# EAGLE design main (EAGLE 9.3.0)
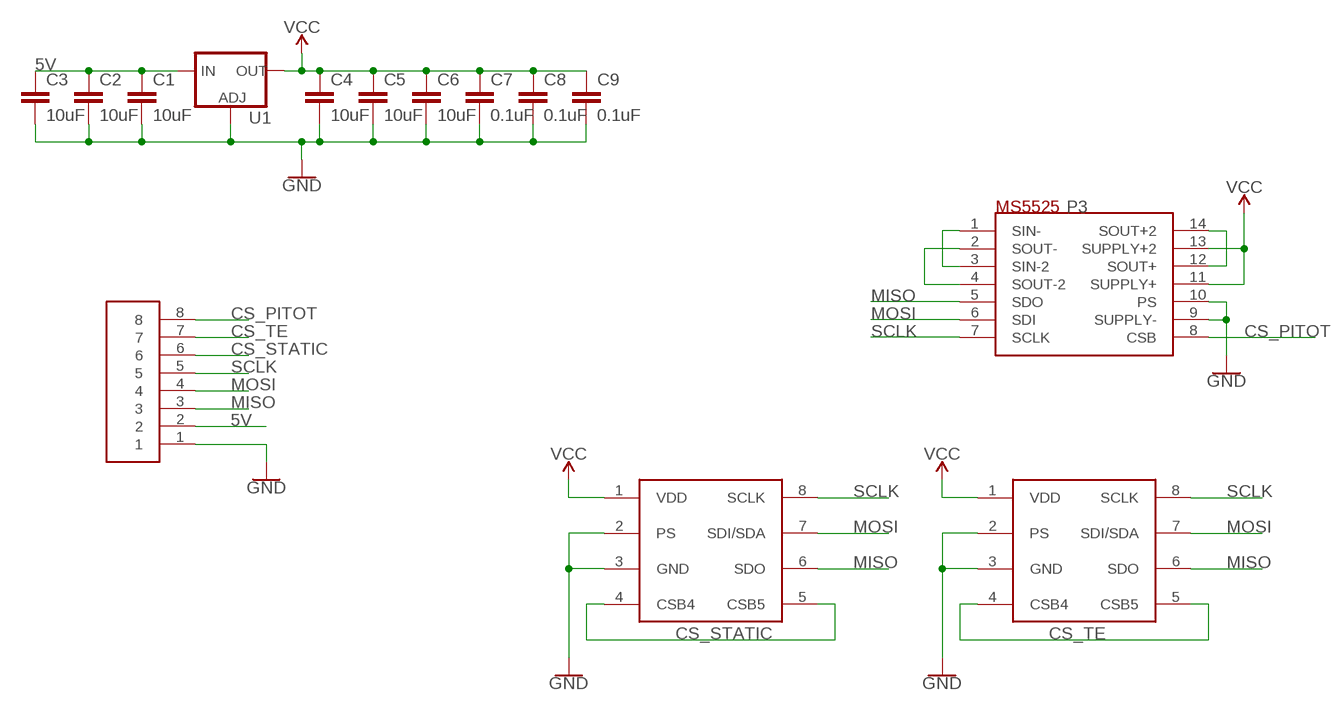
[diagram p0: schematic, sheet 1]

## Parts
C1  10uF  10UF-0805-10V-10%  [0805]
C2  10uF  10UF-0805-10V-10%  [0805]
C3  10uF  10UF-0805-10V-10%  [0805]
C4  10uF  10UF-0805-10V-10%  [0805]
C5  10uF  10UF-0805-10V-10%  [0805]
C6  10uF  10UF-0805-10V-10%  [0805]
C7  0.1uF  0.1UF-0603-25V-5%  [0603]
C8  0.1uF  0.1UF-0603-25V-5%  [0603]
C9  0.1uF  0.1UF-0603-25V-5%  [0603]
P1  MS5611  [MS5611]
P2  MS5611  [MS5611]
P3  MS5525  [SOIC14-WIDE]
U1  V_REG_317SMD  [SOT223]
U$1  HEADER8  [8PINVALULOK]

## Nets
5V: C1.1 C2.1 C3.1 U1.3(IN) U$1.2
CS_PITOT: P3.8(CSB) U$1.8
CS_STATIC: P1.4(CSB4) P1.5(CSB5) U$1.6
CS_TE: P2.4(CSB4) P2.5(CSB5) U$1.7
GND: C1.2 C2.2 C3.2 C4.2 C5.2 C6.2 C7.2 C8.2 C9.2 P1.2(PS) P1.3(GND) P2.2(PS) P2.3(GND) P3.9(SUPPLY-) P3.10(PS) U1.1(ADJ) U$1.1
MISO: P1.6(SDO) P2.6(SDO) P3.5(SDO) U$1.3
MOSI: P1.7(SDI/SDA) P2.7(SDI/SDA) P3.6(SDI) U$1.4
N$3: P3.1(SIN-) P3.3(SIN-2)
N$4: P3.2(SOUT-) P3.4(SOUT-2)
N$8: P3.12(SOUT+) P3.14(SOUT+2)
SCLK: P1.8(SCLK) P2.8(SCLK) P3.7(SCLK) U$1.5
VCC: C4.1 C5.1 C6.1 C7.1 C8.1 C9.1 P1.1(VDD) P2.1(VDD) P3.11(SUPPLY+) P3.13(SUPPLY+2) U1.2(OUT)

## Library data of the parts
C1-C6 = SparkFun-Capacitors:10UF: 10.0µF ceramic capacitors A capacitor is a passive two-terminal electrical component used to store electrical energy temporarily in an electric field.; PROD_ID: CAP-11330
C7-C9 = SparkFun-Capacitors:0.1UF: 0.1µF ceramic capacitors A capacitor is a passive two-terminal electrical component used to store electrical energy temporarily in an electric field.; PROD_ID: CAP-08604
P1 P2 = Custom_old:MS5611
P3 = Custom_old:MS5525
U1 = SparkFun-IC-Power:V_REG_317: Voltage Regulator Standard LM317 adjustable voltage regulator. AOI (Adjust Output Input). Google 'LM317 Calculator' for easy to use app to get the two resistor values needed. 240/720 for 5V output. 240/390 for 3.3V output. Spark Fun Electronics SKU : COM-00527
U$1 = Custom_old:HEADER8

## Board
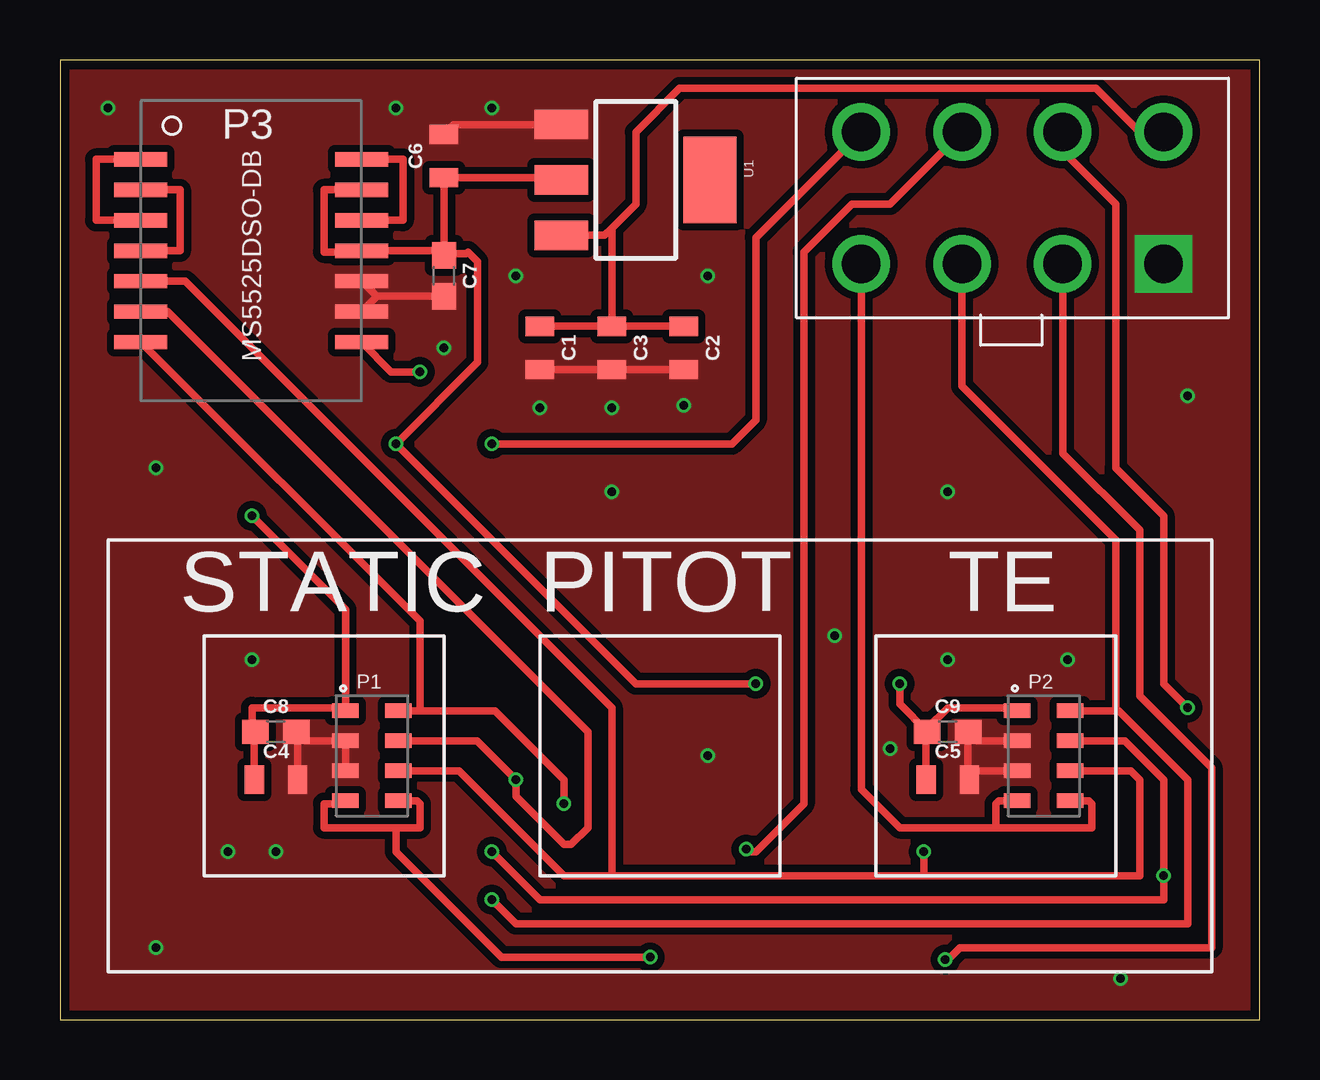
[diagram p1: board, top side]
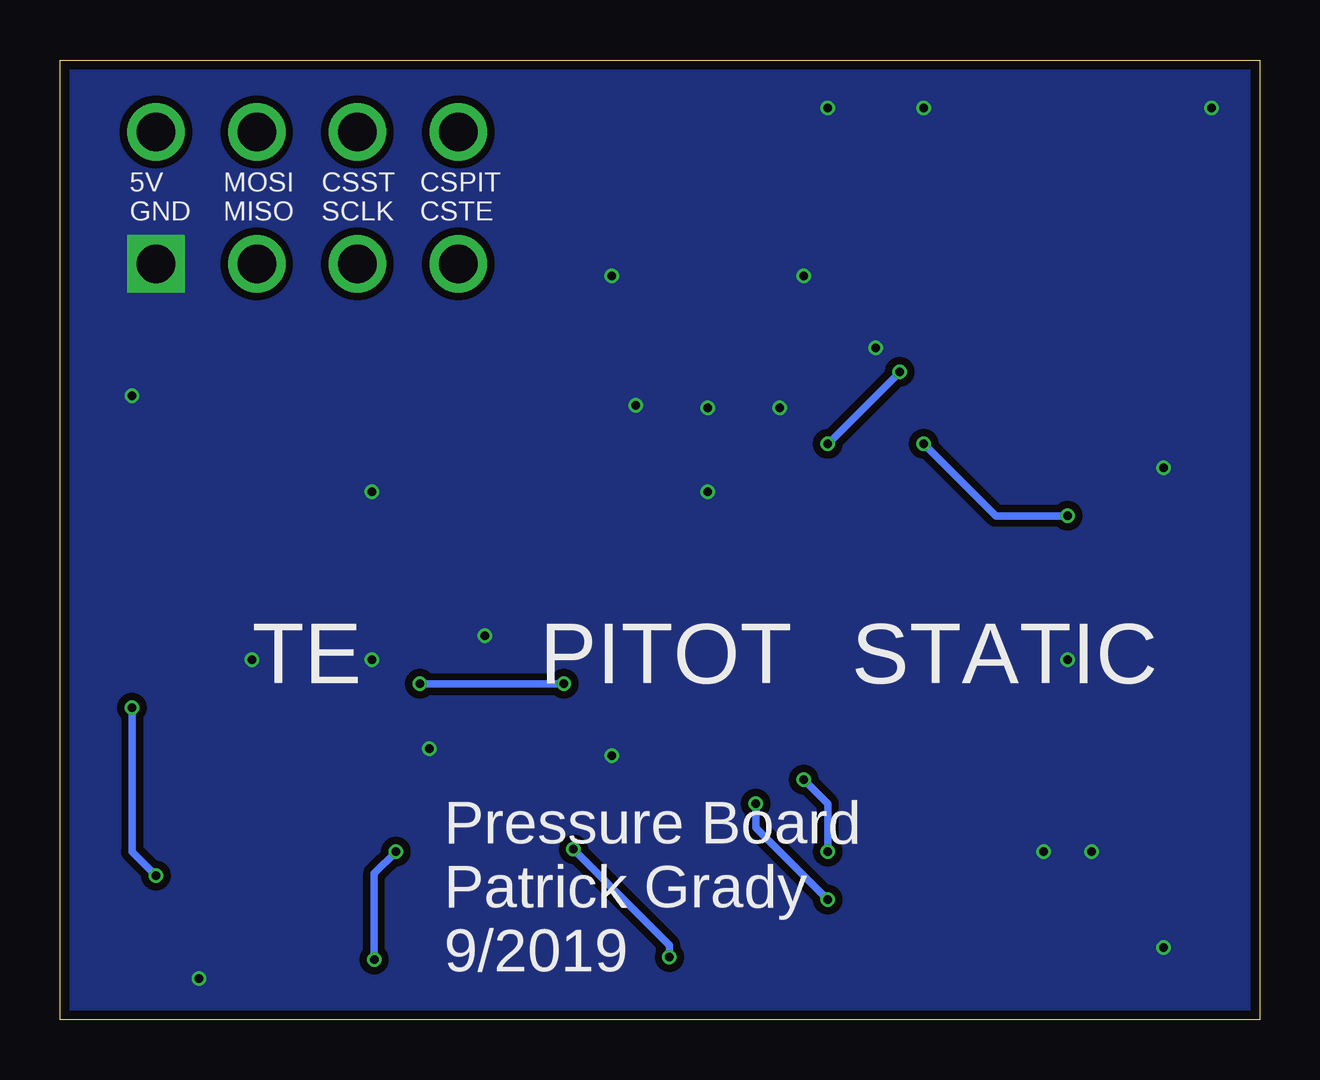
[diagram p2: board, bottom side, seen from below]

Size 50 x 40 mm. Coordinates in mm from the lower left corner, seen from the top.
Outline: 0,0 50,0 50,40 0,40 0,0
Copper layers (1*16): Top 0.035559375mm / dielectric 1.6mm / Bottom 0.035559375mm
Design rules "PATRICK-2lyr": minimum track width 6mil, minimum drill 10mil, track to track 6mil, track to pad 6mil, pad to pad 6mil, via to via 6mil, smd to smd 6mil, copper to edge 15mil, drill to drill 6mil, minimum pad ring 5mil, minimum via ring 5mil, stop-mask expansion 2.5mil, vias tented up to drill 25mil, thermal gap 10mil

### Footprints (pad centres in the part's own frame; a part is rotated, then mirrored left to right if it is on the bottom)
0805 = smd 0.8 x 1.2: 1 -0.9,0; 2 0.9,0
0603 = smd 1.1 x 1: 1 -0.85,0; 2 0.85,0
MS5611 = smd 1.1 x 0.6: 1 -1.1,1.875; 2 -1.1,0.625; 3 -1.1,-0.625; 4 -1.1,-1.875; 5 1.1,-1.875; 6 1.1,-0.625; 7 1.1,0.625; 8 1.1,1.875
SOIC14-WIDE = smd 0.6 x 2.2: 1 0,0; 2 1.27,0; 3 2.54,0; 4 3.81,0; 5 5.08,0; 6 6.35,0; 7 7.62,0; 8 7.62,9.2; 9 6.35,9.2; 10 5.08,9.2; 11 3.81,9.2; 12 2.54,9.2; 13 1.27,9.2; 14 0,9.2
SOT223 = smd 1.219 x 2.235: 1 -2.311,-3.099; 2 0,-3.099; 3 2.311,-3.099 | smd 3.6 x 2.2: 4 0,3.099
8PINVALULOK = drill 1.6 square: 1 0,5.5 | drill 1.6: 2 0,0; 3 4.2,5.5; 4 4.2,0; 5 8.4,5.5; 6 8.4,0; 7 12.6,5.5; 8 12.6,0

### Placement (x,y rotation side)
C1  20,28 270 top
C2  26,28 270 top
C3  23,28 270 top
C4  9,10 0 top
C5  37,10 0 top
C6  16,36 90 top
C7  16,31 270 top
C8  9,12 0 top
C9  37,12 0 top
P1  13,11 0 top
P2  41,11 0 top
P3  3.37,35.86 270 top
U1  24,35 270 top
U$1  46,37 180 top

### Tracks (layer width: path | path; a pad name or v marks a point on that pad's centre or on a via)
5V
  Top 0.305: U$1.2 45,37 43.17,38.83 25.83,38.83 24,37 24,34 23,33 | U1.3 22.69,32.69 23,33 | C1.1 C3.1 | C3.1 C2.1 | 23,33 C3.1
CS_PITOT  (via drill 0.35)
  Top 0.305: U$1.8 29,32.6 29,25 28,24 v18,24 | v15,27 13.81,27 P3.8
  Bottom 0.305: v18,24 v15,27
CS_STATIC  (via drill 0.35)
  Top 0.305: P1.4 11.78,9 11,9 11,8 14,8 | 14,8 15,8 15,9 14.88,9.12 P1.5 | U$1.6 34.6,34 33,34 31,32 31,9 29,7 28.7,7 v28.6,7.1 | v24.6,2.6 18.4,2.6 14,7 14,8
  Bottom 0.305: v28.6,7.1 24.6,3.1 v24.6,2.6
CS_TE
  Top 0.305: 39,8 43,8 43,9 42.88,9.12 P2.5 | 39,8 39,9 39.12,9.12 P2.4 | U$1.7 33.4,9.6 35,8 39,8
GND  (via drill 0.35)
  Top 0.305: C6.2 16.41,37.31 U1.1 | P3.9 13.21,30.15 | 13.21,30.15 C7.2 | P3.10 13.2,30.15 13.21,30.15 | C1.2 C3.2 C2.2 | 37.85,10.05 C9.2 38.23,11.62 P2.2 | 37.85,10.05 C5.2 | P2.3 38.17,10.38 37.85,10.05 | C8.2 9.9,11.95 | 9.9,11.95 C4.2 | P1.3 P1.2 10.22,11.62 9.9,11.95
  other vias: 23,22 37,22 47,26 27,31 19,31 18,38 14,38 8,15 9,7 7,7 34.6,11.3 37,15 42,15 32.3,16 44.2,1.7 4,3 16,28 20,25.5 23,25.5 26,25.6 4,23 2,38 27,11
  pour Top (isolate 0.305, no thermals): -2,40 -2,0 50,0 50,40
  pour Bottom (isolate 0.305, no thermals): -1,40 -1,0 50,0 50,40
MISO  (via drill 0.35)
  Top 0.305: P2.6 44.62,10.38 45,10 45,6 36,6 | 36,6 23,6 | 23,6 21,6 16.62,10.38 P1.6 | U$1.3 41.8,23.6 45,20.4 45,13.5 48,10.5 48,3 37.5,3 37,2.5 v36.9,2.5 | v36,7 36,6 | P3.5 5.22,30.78 23,13 23,6
  Bottom 0.305: v36.9,2.5 36.9,6.1 v36,7
MOSI  (via drill 0.35)
  Top 0.305: P2.7 44.38,11.62 46,10 v46,6 46,5 20,5 v18,7 | P1.7 17.38,11.62 v19,10 19,9.3 21,7.3 21.3,7.3 22,8 22,11 22,11.44 22,12 4.49,29.51 P3.6 | U$1.4 41.8,36.2 44,34 44,23 46,21 46,14 v47,13
  Bottom 0.305: v18,7 18,9 v19,10 | v47,13 47,7 v46,6
N$3
  Top 0.305: P3.1 1.5,35.86 1.5,33.32 P3.3
N$4
  Top 0.305: P3.2 5,34.59 5,32.05 P3.4
N$8
  Top 0.305: P3.14 14.3,35.86 14.3,33.32 P3.12
SCLK  (via drill 0.35)
  Top 0.305: P2.8 44,12.88 | 44,12.88 44.12,12.88 47,10 47,4 19,4 v18,5 | v21,9 21,10 18.12,12.88 15,12.88 | 15,12.88 P1.8 | U$1.5 37.6,26.4 44,20 44,12.88 | P3.7 15,16.61 15,12.88
  Bottom 0.305: v18,5 21,8 v21,9
VCC  (via drill 0.35)
  Top 0.305: U1.2 20.8,35.1 C6.1 C7.1 15.93,31.93 | 15.93,31.93 15.8,32.05 P3.11 12.57,32 11,32 11,34.59 P3.13 | P2.1 39.77,13 37,13 36.15,12.15 C9.1 | C4.1 8.1,11.95 C8.1 8,12.15 8,13 11.78,13 P1.1 11.9,17.1 v8,21 | 15.93,31.93 16.93,31.93 17,32 17.4,31.6 17.4,27.4 v14,24 24,14 v29,14 | C9.1 35,13.15 v35,14 | C5.1 36.1,12 C9.1
  Bottom 0.305: v8,21 11,21 v14,24 | v35,14 v29,14

### Text on the board
tPlace: STATIC | PITOT | TE
bPlace: CSPIT / CSTE | CSST / SCLK | MOSI / MISO | 5V / GND | STATIC | PITOT | TE | Pressure Board / Patrick Grady / 9/2019